# EAGLE schematic ecg (EAGLE 7.5.0)
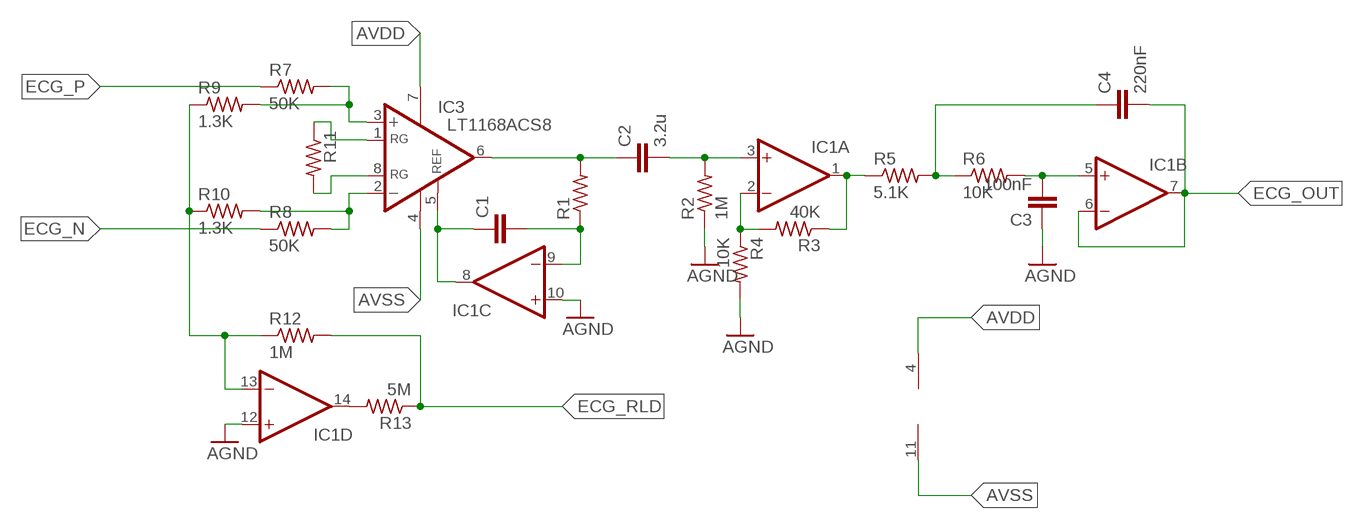
[diagram p0: schematic, sheet 1]

## Parts
C1  CAPEZ  [CAP-PTH-SMALLEZ]
C2  3.2u  CAPEZ  [CAP-PTH-SMALLEZ]
C3  100nF  CAPEZ  [CAP-PTH-SMALLEZ]
C4  220nF  CAPEZ  [CAP-PTH-SMALLEZ]
IC1  4AMP_P4+11N  [DIL14]
IC3  LT1168ACS8  [SOIC8]
R1  R-US_0204/5  [0204/5]
R2  1M  R-US_0204/5  [0204/5]
R3  40K  R-US_0204/5  [0204/5]
R4  10K  R-US_0204/5  [0204/5]
R5  5.1K  R-US_0204/5  [0204/5]
R6  10K  R-US_0204/5  [0204/5]
R7  50K  R-US_0204/5  [0204/5]
R8  50K  R-US_0204/5  [0204/5]
R9  1.3K  R-US_0204/5  [0204/5]
R10  1.3K  R-US_0204/5  [0204/5]
R11  R-US_0204/5  [0204/5]
R12  1M  R-US_0204/5  [0204/5]
R13  5M  R-US_0204/5  [0204/5]

## Nets
AGND: C3.1 IC1.10(C:+IN) IC1.12(D:+IN) R2.1 R4.2
AVDD: IC1.4(P:V+) IC3.7(V+)
AVSS: IC1.11(P:V-) IC3.4(V-)
ECG_N: R8.1
ECG_OUT: C4.2 IC1.6(B:-IN) IC1.7(B:OUT)
ECG_P: R7.1
ECG_RLD: R12.2 R13.1
N$1: C2.1 IC3.6(OUT) R1.2
N$2: C1.2 IC1.9(C:-IN) R1.1
N$3: C1.1 IC1.8(C:OUT) IC3.5(REF)
N$4: C2.2 IC1.3(A:+IN) R2.2
N$5: IC1.2(A:-IN) R3.2 R4.1
N$6: IC1.1(A:OUT) R3.1 R5.1
N$7: C4.1 R5.2 R6.1
N$8: C3.2 IC1.5(B:+IN) R6.2
N$9: IC1.14(D:OUT) R13.2
N$10: IC3.1(RG) R11.1
N$12: IC3.8(RG) R11.2
N$13: IC3.2(-IN) R8.2 R10.2
N$14: IC3.3(+IN) R7.2 R9.2
N$15: IC1.13(D:-IN) R9.1 R10.1 R12.1

## Library data of the parts
C1-C4 = SparkFun-Passives:CAP: Capacitor Standard 0603 ceramic capacitor, and 0.1" leaded capacitor.
IC1 = linear:4AMP_P4+11: OP AMP
IC3 = linear-technology:LT1168: Low Power, Single Resistor Gain Programmable, Precision Instrumentation Amplifier SourcE: LT1168.pdf; MPN: LT1168ACS8; OC_FARNELL: unknown; OC_NEWARK: 57M2316
R1-R13 = adafruit:R-US_: RESISTOR, American symbol